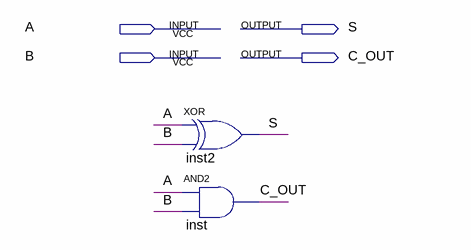
[diagram p0: schematic sheet]
// Quartus schematic HA.bdf as structural Verilog: 2 symbols, 4 pins
module HA (
  input  A,
  input  B,
  output S,
  output C_OUT
);

  xor inst2 (S, A, B);
  and inst (C_OUT, A, B);
endmodule
